# EAGLE design Un_Bus (EAGLE 6.5.0)
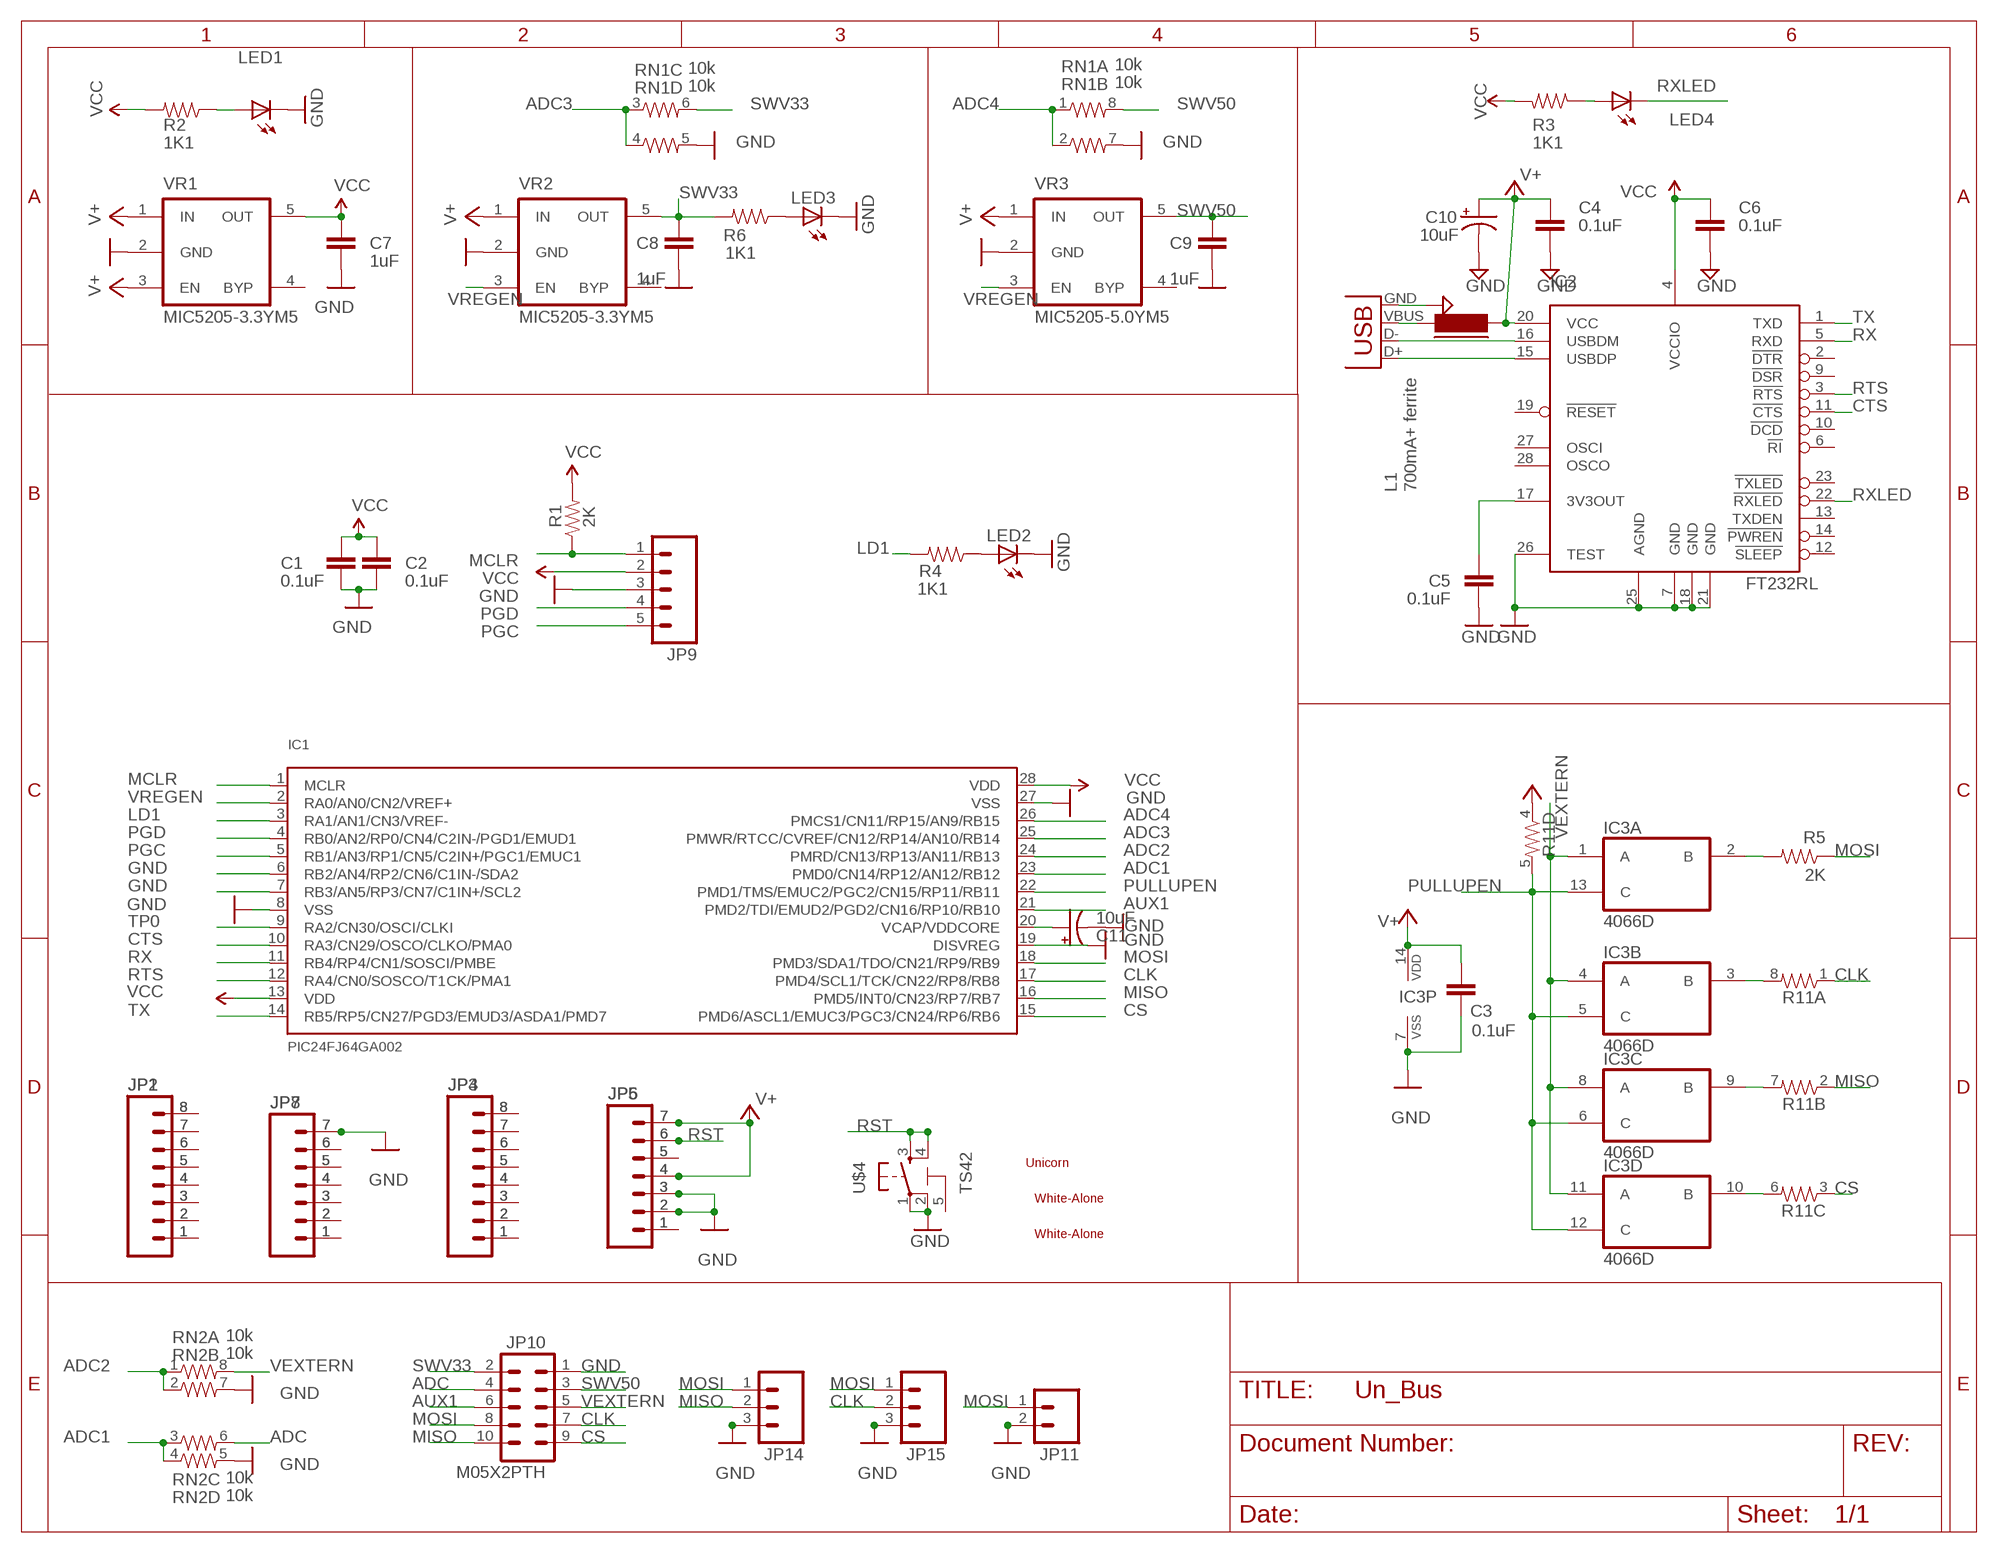
[diagram p0: schematic, sheet 1]

## Parts
C1  0.1uF  CAP0603-CAP  [0603-CAP]
C2  0.1uF  CAP0603-CAP  [0603-CAP]
C3  0.1uF  CAP0603-CAP  [0603-CAP]
C4  0.1uF  CAP0603-CAP  [0603-CAP]
C5  0.1uF  CAP0603-CAP  [0603-CAP]
C6  0.1uF  CAP0603-CAP  [0603-CAP]
C7  1uF  CAP0603-CAP  [0603-CAP]
C8  1uF  CAP0603-CAP  [0603-CAP]
C9  1uF  CAP0603-CAP  [0603-CAP]
C10  10uF  CAP_POL1206  [EIA3216]
C11  10uF  CAP_POL1206  [EIA3216]
IC1  PIC24FJ64GA002  [SSOP28]
IC2  FT232RL  [SSOP28]
IC3  4066D  [SO14]
JP1  M081X08  [1X08]
JP2  M081X08  [1X08]
JP3  M081X08  [1X08]
JP4  M081X08  [1X08]
JP5  M07  [1X07]
JP6  M07  [1X07]
JP7  M07  [1X07]
JP8  M07  [1X07]
JP9  M05PTH  [1X05]
JP10  M05X2PTH  [AVR_ICSP]
JP11  M02PTH  [1X02]
JP14  M03PTH  [1X03]
JP15  M03PTH  [1X03]
L1  700mA+ ferrite  FERRITE-0805  [FB805]
LED1  LED0805  [LED-0805]
LED2  LED0805  [LED-0805]
LED3  LED0805  [LED-0805]
LED4  LED0805  [LED-0805]
R1  2K  RESISTOR0603-RES  [0603-RES]
R2  1K1  RESISTOR0603-RES  [0603-RES]
R3  1K1  RESISTOR0603-RES  [0603-RES]
R4  1K1  RESISTOR0603-RES  [0603-RES]
R5  2K  RESISTOR0603-RES  [0603-RES]
R6  1K1  RESISTOR0603-RES  [0603-RES]
R11  RESISTOR-ARRAY  [RES-NET-0603]
RN1  10k  RESISTOR-ARRAY  [RES-NET-0603]
RN2  10k  RESISTOR-ARRAY  [RES-NET-0603]
U$1  UNICORN  [UNICORN_1]
U$2  WHITE-ALONE_0  [WHITE-ALONE_0]
U$3  WHITE-ALONE_0  [WHITE-ALONE_0]
U$4  TS42  [TS42]
VR1  MIC5205-3.3YM5  MIC5205  [SOT-23-5]
VR2  MIC5205-3.3YM5  MIC5205  [SOT-23-5]
VR3  MIC5205-5.0YM5  MIC5205  [SOT-23-5]
X1  USBSMD  [USB-MINIB]

## Nets
ADC: JP10.4 RN2.6
ADC1: IC1.23(PMD0/CN14/RP12/AN12/RB12) RN2.3 RN2.4
ADC2: IC1.24(PMRD/CN13/RP13/AN11/RB13) RN2.1 RN2.2
ADC3: IC1.25(PMWR/RTCC/CVREF/CN12/RP14/AN10/RB14) RN1.3 RN1.4
ADC4: IC1.26(PMCS1/CN11/RP15/AN9/RB15) RN1.1 RN1.2
AUX1: IC1.21(PMD2/TDI/EMUD2/PGD2/CN16/RP10/RB10) JP10.6
CLK: IC1.17(PMD4/SCL1/TCK/CN22/RP8/RB8) JP10.7 JP15.2 R11.1
CS: IC1.15(PMD6/ASCL1/EMUC3/PGC3/CN24/RP6/RB6) JP10.9 R11.3
CTS: IC1.10(RA3/CN29/OSCO/CLKO/PMA0) IC2.11(!CTS)
GND: C1.2 C2.2 C3.2 C4.2 C5.2 C6.2 C7.2 C8.2 C9.2 C10.C(-) C11.C(-) IC1.6(RB2/AN4/RP2/CN6/C1IN-/SDA2) IC1.7(RB3/AN5/RP3/CN7/C1IN+/SCL2) IC1.8(VSS) IC1.19(DISVREG) IC1.27(VSS) IC2.7(GND) IC2.18(GND) IC2.21(GND) IC2.25(AGND) IC2.26(TEST) IC3.7(P:VSS) JP5.2 JP5.3 JP6.2 JP6.3 JP7.7 JP8.7 JP9.3 JP10.1 JP11.2 JP14.3 JP15.3 LED1.2(C) LED2.2(C) LED3.2(C) RN1.5 RN1.7 RN2.5 RN2.7 U$4.1 U$4.2 VR1.2(GND) VR2.2(GND) VR3.2(GND) X1.GND
LD1: IC1.3(RA1/AN1/CN3/VREF-) R4.2
MCLR: IC1.1(MCLR) JP9.1 R1.1
MISO: IC1.16(PMD5/INT0/CN23/RP7/RB7) JP10.10 JP14.2 R11.2
MOSI: IC1.18(PMD3/SDA1/TDO/CN21/RP9/RB9) JP10.8 JP11.1 JP14.1 JP15.1 R5.1
N$1: IC3.2(A:B) R5.2
N$2: IC3.3(B:B) R11.8
N$3: C11.A(+) IC1.20(VCAP/VDDCORE)
N$4: IC3.10(D:B) R11.6
N$5: IC3.9(C:B) R11.7
N$6: LED2.1(A) R4.1
N$7: LED1.1(A) R2.1
N$8: JP1.1 JP2.1
N$9: C5.1 IC2.17(3V3OUT)
N$10: JP1.2 JP2.2
N$11: JP1.3 JP2.3
N$12: JP1.4 JP2.4
N$13: LED4.1(A) R3.1
N$14: JP1.5 JP2.5
N$15: IC2.15(USBDP) X1.D+
N$16: IC2.16(USBDM) X1.D-
N$17: JP1.6 JP2.6
N$18: LED3.1(A) R6.1
N$19: JP1.7 JP2.7
N$20: JP1.8 JP2.8
N$21: JP3.1 JP4.1
N$22: JP3.2 JP4.2
N$23: JP3.3 JP4.3
N$24: JP3.4 JP4.4
N$25: JP3.5 JP4.5
N$26: JP3.6 JP4.6
N$27: JP3.7 JP4.7
N$28: JP3.8 JP4.8
N$29: JP5.1 JP6.1
N$30: L1.1 X1.VBUS
N$33: JP5.5 JP6.5
N$36: JP7.1 JP8.1
N$37: JP7.2 JP8.2
N$38: JP7.3 JP8.3
N$39: JP7.4 JP8.4
N$40: JP7.5 JP8.5
N$41: JP7.6 JP8.6
PGC: IC1.5(RB1/AN3/RP1/CN5/C2IN+/PGC1/EMUC1) JP9.5
PGD: IC1.4(RB0/AN2/RP0/CN4/C2IN-/PGD1/EMUD1) JP9.4
PULLUPEN: IC1.22(PMD1/TMS/EMUC2/PGC2/CN15/RP11/RB11) IC3.5(B:C) IC3.6(C:C) IC3.12(D:C) IC3.13(A:C) R11.5
RST: JP5.6 JP6.6 U$4.3 U$4.4
RTS: IC1.12(RA4/CN0/SOSCO/T1CK/PMA1) IC2.3(!RTS)
RX: IC1.11(RB4/RP4/CN1/SOSCI/PMBE) IC2.5(RXD)
RXLED: IC2.22(!RXLED) LED4.2(C)
SWV33: C8.1 JP10.2 R6.2 RN1.6 VR2.5(OUT)
SWV50: C9.1 JP10.3 RN1.8 VR3.5(OUT)
TP0: IC1.9(RA2/CN30/OSCI/CLKI)
TX: IC1.14(RB5/RP5/CN27/PGD3/EMUD3/ASDA1/PMD7) IC2.1(TXD)
V+: C3.1 C4.1 C10.A(+) IC2.20(VCC) IC3.14(P:VDD) JP5.4 JP5.7 JP6.4 JP6.7 L1.2 R11.4 VR1.1(IN) VR1.3(EN) VR2.1(IN) VR3.1(IN)
VCC: C1.1 C2.1 C6.1 C7.1 IC1.13(VDD) IC1.28(VDD) IC2.4(VCCIO) JP9.2 R1.2 R2.2 R3.2 VR1.5(OUT)
VEXTERN: IC3.1(A:A) IC3.4(B:A) IC3.8(C:A) IC3.11(D:A) JP10.5 RN2.8
VREGEN: IC1.2(RA0/AN0/CN2/VREF+) VR2.3(EN) VR3.3(EN)
Unconnected: IC2.2(!DTR) IC2.6(!RI) IC2.9(!DSR) IC2.10(!DCD) IC2.12(!SLEEP) IC2.13(TXDEN) IC2.14(!PWREN) IC2.19(!RESET) IC2.23(!TXLED) IC2.27(OSCI) IC2.28(OSCO) U$4.5 VR1.4(BYP) VR2.4(BYP) VR3.4(BYP)

## Library data of the parts
C1-C9 = 2SparkFun:CAP: Capacitor Standard 0603 ceramic capacitor, and 0.1" leaded capacitor.
C10 C11 = 2SparkFun:CAP_POL: Capacitor Polarized These are standard SMD and PTH capacitors. Normally 10uF, 47uF, and 100uF in electrolytic and tantalum varieties. Always verify the external diameter of the through hole cap, it varies with capacity, voltage, and manufacturer. The EIA devices should be standard.
IC1 = dp_devices:PIC24FJ64GA002: 16-bit General Purpose Flash Microcontroller
IC2 = dp_devices:FT232RL: USB to serial UART interface
IC3 = 40xx:4066: Quad bilateral ANALOG SWITCH
JP1-JP4 = 2SparkFun:M08: Header 8 Standard 8-pin 0.1" header. Use with straight break away headers (SKU : PRT-00116), right angle break away headers (PRT-00553), swiss pins (PRT-00743), machine pins (PRT-00117), and female headers (PRT-00115).
JP5-JP8 = 2SparkFun:M07: Header 7 Standard 7-pin 0.1" header. Use with straight break away headers (SKU : PRT-00116), right angle break away headers (PRT-00553), swiss pins (PRT-00743), machine pins (PRT-00117), and female headers (PRT-00115). NOTES ON THE VARIANTS LOCK and LOCK_LONGPADS... This footprint was designed to help hold the alignment of a through-hole component (i.e. 7-pin header) while soldering it into place. You may notice that each hole has been shifted either up or down by 0.005 of an inch from it's more standard position (which is usually a perfectly straight line). This slight alteration caused the pins (the squares in the middle) to touch the edges of the holes. Because they are alternating, it causes a "brace" to hold the header in place. 0.005 has proven to be the perfect amount of "off-center" position when using our standard breakaway headers. Although looks a little odd when you look at the bare footprint, once you have a header in there, the alteration is very hard to notice. Also, if you push a header all the way into place, it is covered up entirely on the bottom side. This idea of altering the position of holes to aid alignment will be further integrated into the Sparkfun Library for other footprints. It can help hold any component with 3 or more connection pins.
JP9 = 2SparkFun:M05: Header 5 Standard 5-pin 0.1" header. Use with straight break away headers (SKU : PRT-00116), right angle break away headers (PRT-00553), swiss pins (PRT-00743), machine pins (PRT-00117), and female headers (PRT-00115). Molex polarized connector foot print use with SKU : PRT-08230 with associated crimp pins and housings.
JP10 = 2SparkFun:M05X2: Header 5x2 Standard 10-pin dual row 0.1" header. Commonly used with AVR-ISP. Use with Spark Fun Electronics SKU: PRT-00778
JP11 = 2SparkFun:M02: Header 2 Standard 2-pin 0.1" header. Use with straight break away headers (SKU : PRT-00116), right angle break away headers (PRT-00553), swiss pins (PRT-00743), machine pins (PRT-00117), and female headers (PRT-00115). Molex polarized connector foot print use with SKU : PRT-08233 with associated crimp pins and housings.
JP14 JP15 = 2SparkFun:M03: Header 3 Standard 3-pin 0.1" header. Use with straight break away headers (SKU : PRT-00116), right angle break away headers (PRT-00553), swiss pins (PRT-00743), machine pins (PRT-00117), and female headers (PRT-00115). Molex polarized connector foot print use with SKU : PRT-08232 with associated crimp pins and housings.
L1 = 2SparkFun:FERRITE: Ferrite bead in various packages
LED1-LED4 = 2SparkFun:LED: LEDs Standard schematic elements and footprints for 5mm, 3mm, 1206, and 0603 sized LEDs. 5mm - Spark Fun Electronics SKU : COM-00529 (and others)
R1 R5 = 2SparkFun:RESISTOR: Resistor
R2-R4 R6 = 1SparkFun:RESISTOR: Resistor
R11 RN1 RN2 = 2SparkFun:RESISTOR-ARRAY: Array Chip Resistor Source: RS Component / Phycomp
U$1 = 2SparkFun:UNICORN
U$2 U$3 = 2SparkFun:WHITE-ALONE
U$4 = 2SparkFun:TS42
VR1-VR3 = dp_devices:MIC5205: 150ma Low-Noise LDO Regulator
X1 = 2SparkFun:USB: USB Connectors USB-B-PTH is fully proven SKU : PRT-00139 USB-miniB is fully proven SKU : PRT-00587 USB-A-PCB is untested. USB-A-H is throughly reviewed, but untested. Spark Fun Electronics SKU : PRT-00437 USB-B-SMT is throughly reviewed, but untested. Needs silkscreen touching up. USB-A-S has not been used/tested USB-MB-H has not been used/tested

## Net classes
0 default: width 0.254 mm, clearance 0.254 mm
2 gnd: width 0.305 mm, drill 0.559 mm, clearance 0.254 mm

## Board
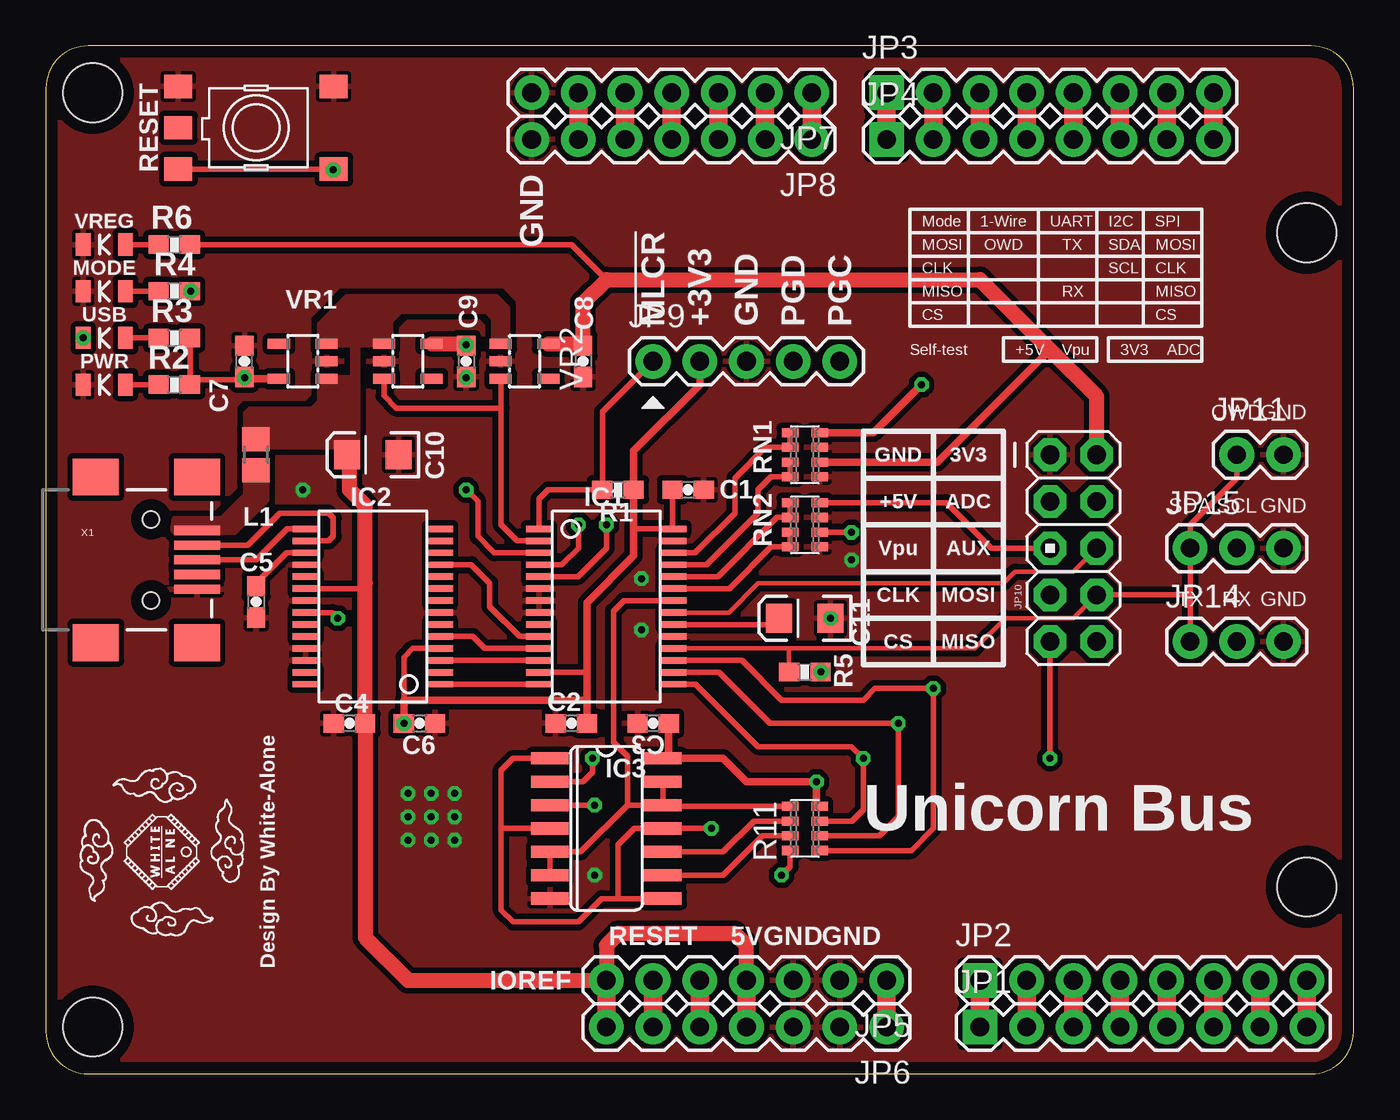
[diagram p1: board, top side]
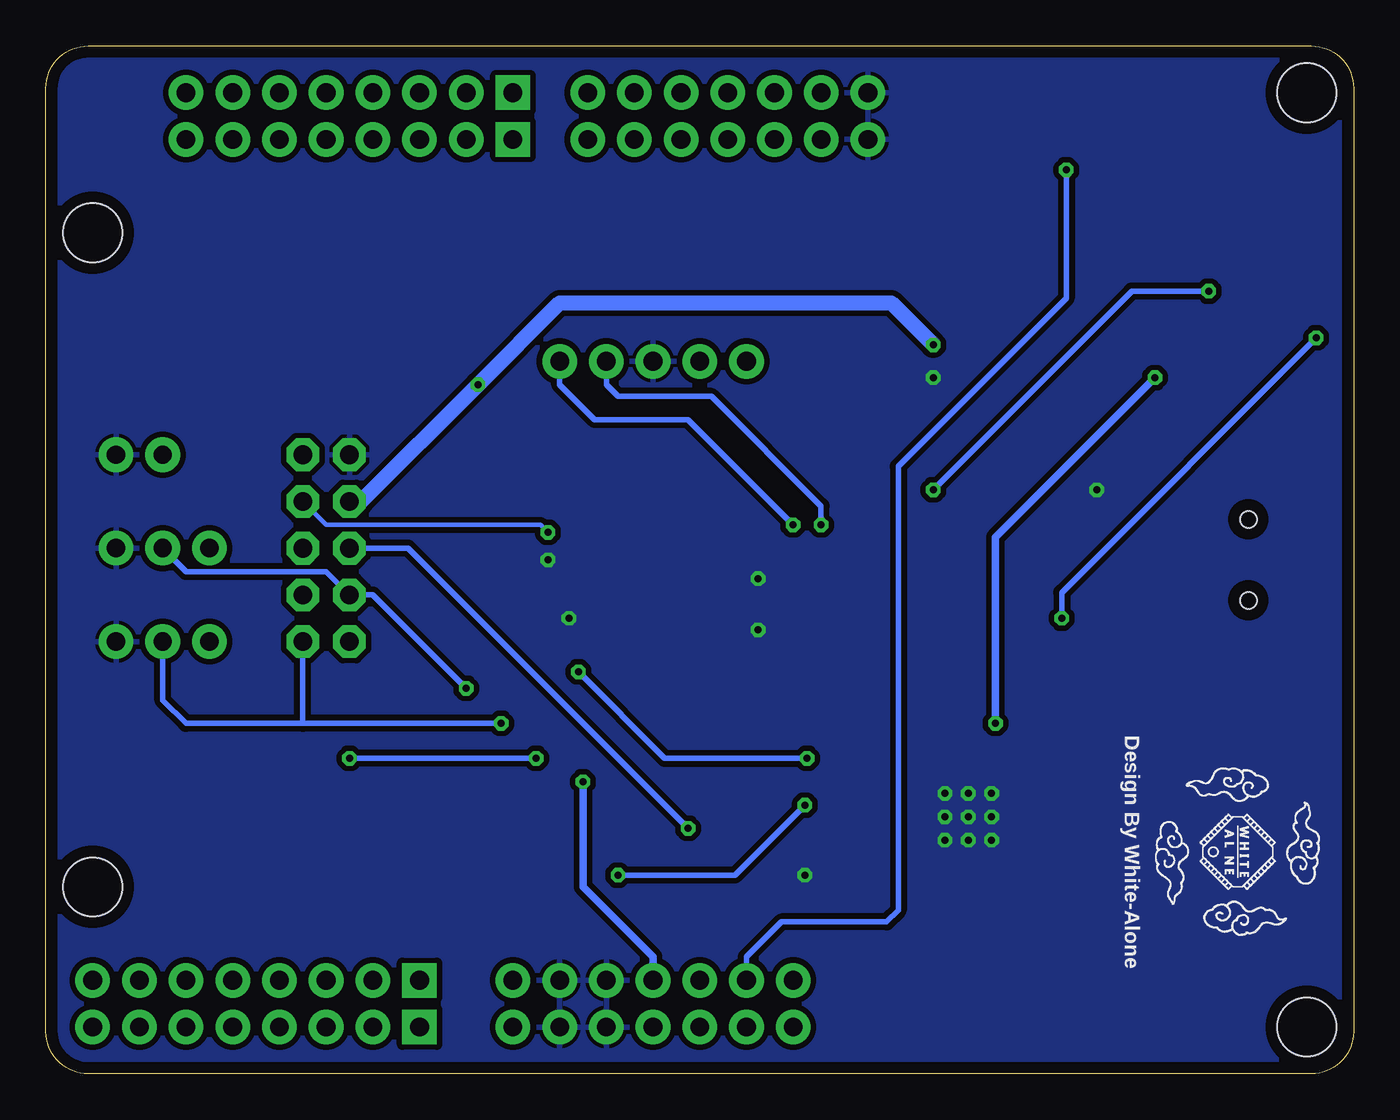
[diagram p2: board, bottom side, seen from below]

Size 71.12 x 55.88 mm. Coordinates in mm from the lower left corner, seen from the top.
Copper layers (1*16): Top 0.035mm / dielectric 1.5mm / Bottom 0.035mm
Design rules "yun": minimum track width 8mil, minimum drill 15mil, track to track 8mil, track to pad 8mil, pad to pad 8mil, via to via 8mil, smd to smd 8mil, copper to edge 25mil, drill to drill 8mil, minimum pad ring 10mil, minimum via ring 8mil, stop-mask expansion 4mil, vias tented up to drill 20mil, thermal gap 8mil

### Footprints (pad centres in the part's own frame; a part is rotated, then mirrored left to right if it is on the bottom)
0603-CAP = smd 1.1 x 1: 1 -0.85,0; 2 0.85,0
EIA3216 = smd 1.4 x 1.6: A 1.4,0; C -1.4,0
SSOP28 = smd 0.348 x 1.397: 1 -4.225,-3.656; 2 -3.575,-3.656; 3 -2.925,-3.656; 4 -2.275,-3.656; 5 -1.625,-3.656; 6 -0.975,-3.656; 7 -0.325,-3.656; 8 0.325,-3.656; 9 0.975,-3.656; 10 1.625,-3.656; 11 2.275,-3.656; 12 2.925,-3.656; 13 3.575,-3.656; 14 4.225,-3.656; 15 4.225,3.656; 16 3.575,3.656; 17 2.925,3.656; 18 2.275,3.656; 19 1.625,3.656; 20 0.975,3.656; 21 0.325,3.656; 22 -0.325,3.656; 23 -0.975,3.656; 24 -1.625,3.656; 25 -2.275,3.656; 26 -2.925,3.656; 27 -3.575,3.656; 28 -4.225,3.656
SO14 = smd 0.66 x 2.032: 1 -3.81,-3.073; 2 -2.54,-3.073; 3 -1.27,-3.073; 4 0,-3.073; 5 1.27,-3.073; 6 2.54,-3.073; 7 3.81,-3.073; 8 3.81,3.073; 9 2.54,3.073; 10 1.27,3.073; 11 0,3.073; 12 -1.27,3.073; 13 -2.54,3.073; 14 -3.81,3.073
1X08 = drill 1.016 pad 1.88 square: 1 0,0 | drill 1.016 pad 1.88: 2 2.54,0; 3 5.08,0; 4 7.62,0; 5 10.16,0; 6 12.7,0; 7 15.24,0; 8 17.78,0
1X07 = drill 1.016 pad 1.88: 1 0,0; 2 2.54,0; 3 5.08,0; 4 7.62,0; 5 10.16,0; 6 12.7,0; 7 15.24,0
1X05 = drill 1.016 pad 1.88: 1 0,0; 2 2.54,0; 3 5.08,0; 4 7.62,0; 5 10.16,0
AVR_ICSP = drill 1.016 pad 1.778 octagon: 1 -1.27,5.08; 2 1.27,5.08; 3 -1.27,2.54; 4 1.27,2.54; 5 -1.27,0; 6 1.27,0; 7 -1.27,-2.54; 8 1.27,-2.54; 9 -1.27,-5.08; 10 1.27,-5.08
1X02 = drill 1 pad 1.88: 1 0,0; 2 2.54,0
1X03 = drill 1 pad 1.88: 1 0,0; 2 2.54,0; 3 5.08,0
FB805 = smd 1.3 x 1.5: 1 -0.85,0; 2 0.85,0
LED-0805 = smd 0.8 x 1.2: 1 -1.154,0; 2 1.154,0
0603-RES = smd 1.1 x 1: 1 -0.85,0; 2 0.85,0
RES-NET-0603 = smd 0.5 x 0.9: 1 -1.2,-0.8; 2 -0.4,-0.8; 3 0.4,-0.8; 4 1.2,-0.8; 5 1.2,0.8; 6 0.4,0.8; 7 -0.4,0.8; 8 -1.2,0.8
UNICORN_1 = hole 3.2: -30.48,-25.4; 35.56,17.78; 35.56,-17.78; -30.48,25.4
TS42 = smd 1.524 x 1.27: 1 -4.229,2.25; 2 4.229,2.25; 3 -4.229,-2.25; 4 4.229,-2.25; 5 -4.229,-0.002
SOT-23-5 = smd 0.55 x 1.2: 1 -0.95,-1.3; 2 0,-1.3; 3 0.95,-1.3; 4 0.95,1.3; 5 -0.95,1.3
USB-MINIB = smd 2.5 x 0.5: D+ 2.5,0; D- 2.5,0.8; GND 2.5,-1.6; ID 2.5,-0.8; VBUS 2.5,1.6 | smd 2.5 x 2: MTN1 -3,4.5; MTN2 2.5,4.5; MTN3 -3,-4.5; MTN4 2.5,-4.5 | hole 0.9: 0,2.2; 0,-2.2

### Placement (x,y rotation side)
C1  34.92,31.75 0 top
C2  28.57,19.05 180 top
C3  33.02,19.05 180 top
C4  16.51,19.05 180 top
C5  11.43,25.65 270 top
C6  20.32,19.05 0 top
C7  10.79,38.73 90 top
C8  29.21,38.73 270 top
C9  22.86,38.73 270 top
C10  17.78,33.66 180 top
C11  41.27,24.77 180 top
IC1  30.48,25.4 270 top
IC2  17.78,25.4 90 top
IC3  30.48,13.34 270 top
JP1  50.8,2.54 0 top
JP2  50.8,5.08 0 top
JP3  45.72,53.34 0 top
JP4  45.72,50.8 0 top
JP5  45.72,5.08 180 top
JP6  45.72,2.54 180 top
JP7  41.66,53.34 180 top
JP8  41.66,50.8 180 top
JP9  33.02,38.73 0 top
JP10  55.88,28.57 0 top
JP11  64.77,33.66 0 top
JP14  62.23,23.5 0 top
JP15  62.23,28.57 0 top
L1  11.43,33.66 90 top
LED1  3.17,37.47 180 top
LED2  3.17,42.55 180 top
LED3  3.17,45.09 180 top
LED4  3.17,40.01 180 top
R1  31.11,31.75 0 top
R2  6.99,37.47 0 top
R3  6.99,40.01 0 top
R4  6.99,42.55 0 top
R5  41.27,21.84 0 top
R6  6.99,45.09 0 top
R11  41.27,13.34 90 top
RN1  41.27,33.66 270 top
RN2  41.27,29.84 270 top
U$1  33.02,27.94 0 top
U$2  6.35,12.06 90 top
U$3  6.35,12.06 270 bottom
U$4  11.43,51.44 0 top
VR1  13.97,38.73 90 top
VR2  26.04,38.73 270 top
VR3  19.68,38.73 270 top
X1  5.71,27.94 0 top

### Tracks (layer width: path | path; a pad name or v marks a point on that pad's centre or on a via)
ADC  (via drill 0.38)
  Top 0.305: v43.81,29.44 42.71,29.44 RN2.6
  Bottom 0.254: JP10.4 55.88,29.84 44.22,29.84 v43.81,29.44
ADC1
  Top 0.305: RN2.3 RN2.4 39.44,28.64 37.17,26.38 IC1.23
ADC2
  Top 0.305: RN2.1 RN2.2 39.77,30.25 36.55,27.02 IC1.24
ADC3
  Top 0.305: RN1.3 RN1.4 39.44,32.45 38.73,31.75 38.73,30.48 35.93,27.68 IC1.25
ADC4
  Top 0.305: RN1.1 RN1.2 39.13,34.05 37.47,32.38 37.47,30.48 35.31,28.32 IC1.26
AUX1
  Top 0.254: IC1.21 37.14,25.07 38.73,26.67 52.07,26.67 52.7,27.3 55.88,27.3 JP10.6
CLK  (via drill 0.38)
  Top 0.305: IC1.17 37.85,22.48 40.01,20.32 44.45,20.32 45.09,20.95 v48.26,20.95 48.26,13.34 47.06,12.13 R11.1
  Bottom 0.305: v48.26,20.95 53.34,26.04 JP10.7 55.88,27.3 63.5,27.3 JP15.2
CS  (via drill 0.38)
  Top 0.305: IC1.15 35.34,21.18 38.73,17.78 43.81,17.78 v44.45,17.14 44.45,14.35 43.83,13.73 R11.3 | v54.61,17.14 JP10.9
  Bottom 0.305: v44.45,17.14 v54.61,17.14
CTS
  Top 0.305: IC1.10 25.75,23.77 24.13,25.4 24.13,26.67 23.12,27.68 IC2.11
GND  (via drill 0.38)
  other vias: 19.68,15.24 20.95,15.24 22.23,15.24 22.23,13.97 20.95,13.97 19.68,13.97 19.68,12.7 20.95,12.7 22.23,12.7 22.86,37.85 42.67,24.77 32.38,26.92 43.81,27.94 32.38,24.13 29.84,10.79 13.97,31.75
  pour Top (isolate 0.305, rank 2): 0,0 70.92,0 71.12,0.2 71.12,55.88 0.2,55.88 0,55.68
  pour Bottom (isolate 0.305, rank 2): 0,0 70.92,0 71.12,0.2 71.12,55.88 0.2,55.88 0,55.68
LD1  (via drill 0.38)
  Top 0.305: IC1.3 24.38,28.32 23.5,29.21 23.5,31.11 v22.86,31.75 | R4.2 v7.87,42.55
  Bottom 0.305: v7.87,42.55 12.06,42.55 v22.86,31.75
MCLR
  Top 0.305: IC1.1 26.82,31.27 27.3,31.75 R1.1 30.27,35.98 JP9.1
MISO  (via drill 0.38)
  Top 0.305: IC1.16 36.59,21.82 39.37,19.05 v46.35,19.05 46.35,13.97 45.32,12.94 R11.2
  Bottom 0.305: v46.35,19.05 57.15,19.05 | 57.15,19.05 63.5,19.05 64.77,20.32 JP14.2 | 57.15,19.05 JP10.10
MOSI
  Top 0.254: IC1.18 40.42,23.12 | R5.1 40.42,23.12 | 40.42,23.12 50.53,23.12 52.17,24.77 55.88,24.77 JP10.8
  Top 0.305: JP14.1 62.23,26.04 | 62.23,26.04 JP15.1 62.23,29.84 64.77,32.38 JP11.1 | JP10.8 62.23,26.04
N$1  (via drill 0.38)
  Top 0.305: v29.72,17.14 29.72,16.38 29.21,15.88 IC3.2 | v42.16,21.84 R5.2
  Bottom 0.305: v42.16,21.84 37.47,17.14 v29.72,17.14
N$2  (via drill 0.38)
  Top 0.305: IC3.3 v29.84,14.61 | R11.8 40.48,11.27 v40.01,10.79
  Bottom 0.305: v29.84,14.61 33.66,10.79 v40.01,10.79
N$3
  Top 0.305: IC1.20 40.17,24.43 C11.A
N$4
  Top 0.305: R11.6 38.5,13.73 36.83,12.06 IC3.10
N$5
  Top 0.305: R11.7 38.97,12.94 36.83,10.79 IC3.9
N$6
  Top 0.305: LED2.1 R4.1
N$7
  Top 0.305: R2.1 LED1.1
N$8
  Top 1.016: JP1.1 JP2.1
N$9
  Top 0.305: IC2.17 13.09,28.32 11.43,26.67 C5.1
N$10
  Top 1.016: JP1.2 JP2.2
N$11
  Top 1.016: JP1.3 JP2.3
N$12
  Top 1.016: JP1.4 JP2.4
N$13
  Top 0.305: R3.1 LED4.1
N$14
  Top 1.016: JP1.5 JP2.5
N$15
  Top 0.305: IC2.15 13.12,29.62 11.43,27.94 X1.D+
N$16
  Top 0.305: X1.D- 10.96,28.74 12.7,30.48 15.37,30.48 15.62,30.23 15.62,29.21 15.39,28.98 IC2.16
N$17
  Top 1.016: JP1.6 JP2.6
N$18
  Top 0.305: LED3.1 R6.1
N$19
  Top 1.016: JP1.7 JP2.7
N$20
  Top 1.016: JP1.8 JP2.8
N$21
  Top 1.016: JP3.1 JP4.1
N$22
  Top 1.016: JP4.2 JP3.2
N$23
  Top 1.016: JP4.3 JP3.3
N$24
  Top 1.016: JP4.4 JP3.4
N$25
  Top 1.016: JP4.5 JP3.5
N$26
  Top 1.016: JP4.6 JP3.6
N$27
  Top 1.016: JP4.7 JP3.7
N$28
  Top 1.016: JP3.8 JP4.8
N$29
  Top 1.016: JP6.1 JP5.1
N$30
  pour Top (isolate 0.305, no thermals): 6.99,29.39 10.29,29.39 12.06,31.17 12.06,33.27 10.79,33.27 10.79,31.5 9.53,30.23 6.99,30.23 6.86,30.1 6.86,29.51
N$33
  Top 1.016: JP6.5 JP5.5
N$36
  Top 1.016: JP8.1 JP7.1
N$37
  Top 1.016: JP8.2 JP7.2
N$38
  Top 1.016: JP8.3 JP7.3
N$39
  Top 1.016: JP8.4 JP7.4
N$40
  Top 1.016: JP8.5 JP7.5
N$41
  Top 1.016: JP8.6 JP7.6
PGC  (via drill 0.38)
  Top 0.305: IC1.5 28.93,27.02 30.48,28.57 v30.48,29.84
  Bottom 0.305: v30.48,29.84 36.2,35.56 41.27,35.56 43.18,37.47 JP9.5
PGD  (via drill 0.38)
  Top 0.305: IC1.4 28.06,27.68 28.96,28.57 v28.96,29.84
  Bottom 0.305: JP9.4 40.64,37.47 40.01,36.83 34.92,36.83 28.96,30.86 v28.96,29.84
PULLUPEN
  Top 0.305: IC3.6 IC3.5 29.08,12.06 31.62,14.61 | IC3.13 IC3.12 33.02,14.61 | 33.02,14.61 31.62,14.61 | IC1.22 31.44,25.73 30.86,25.15 30.86,18.03 31.62,17.27 31.62,14.61 | R11.5 33.09,14.54 33.02,14.61
RST  (via drill 0.38)
  Top 0.305: U$4.3 U$4.4 v15.62,49.15
  Top 1.016: JP5.6 JP6.6
  Bottom 0.305: JP5.6 33.02,6.35 31.11,8.26 25.4,8.26 24.77,8.89 24.77,33.02 15.62,42.16 v15.62,49.15
RTS
  Top 0.305: IC2.3 IC1.12
RX
  Top 0.305: IC1.11 23.86,23.12 23.21,23.77 IC2.5
RXLED  (via drill 0.38)
  Top 0.305: 1.91,39.89 LED4.2 v2.03,40.01 | v15.88,24.77 15.56,25.07 IC2.22
  Bottom 0.305: v2.03,40.01 15.88,26.16 v15.88,24.77
SWV33
  Top 0.305: R6.2 28.57,45.09 30.48,43.18
  Top 0.406: RN1.6 48.49,33.26 54.61,39.37
  Top 0.813: VR2.5 29.11,39.69 C8.1 29.21,41.91 30.48,43.18 50.8,43.18 54.61,39.37 57.15,36.83 JP10.2
SWV50  (via drill 0.38)
  Top 0.406: RN1.8 45.02,34.85 v47.62,37.47
  Top 0.813: C9.1 v22.86,39.62 22.8,39.69 VR3.5
  Bottom 0.813: v22.86,39.62 25.15,41.91 43.18,41.91 v47.62,37.47 53.98,31.11 JP10.3
TX
  Top 0.305: IC2.1 IC1.14
V+  (via drill 0.38)
  Top 0.305: IC2.20 17.07,26.38 17.36,26.67
  Top 0.406: 33.87,17.14 36.83,17.14 38.1,15.88 v41.91,15.88 41.91,14.7 R11.4 | 33.87,17.14 IC3.14 | C3.1 33.87,17.14
  Top 0.813: JP5.4 38.1,6.99 37.47,7.62 31.11,7.62 30.48,6.99 JP5.7 19.68,5.08 17.36,7.41 C4.1 17.36,26.67 17.36,30.9 16.51,31.75 16.51,33.52 C10.A
  Top 1.016: JP5.7 JP6.7 | JP6.4 JP5.4
  Bottom 0.406: v41.91,15.88 41.91,10.16 38.1,6.35 JP5.4
  pour Top (isolate 0.305, no thermals): 10.79,34.04 17.02,34.04 17.02,39.57 18.8,39.57 18.8,40.89 19.3,41.4 23.93,41.4 24.28,41.02 24.28,39.62 25.17,39.62 25.17,41.66 24.54,42.29 16.33,42.29 14.83,40.77 14.83,39.57 16.64,39.57 16.64,37.9 14.83,37.9 14.83,36.58 14.45,36.2 11.05,36.2 10.79,35.94
VCC  (via drill 0.38)
  Top 0.305: 34.14,31.69 C1.1 34.08,29.62 IC1.28 31.96,29.62 | 10.89,37.78 C7.1 v10.79,37.85 10.67,37.72 8.09,37.72 R2.2 R3.2 | IC1.13 29.43,21.82 | IC2.4 19.95,23.12 19.47,22.64 19.47,20.32
  Top 0.406: VR1.5 10.89,37.78 | 29.43,20.32 29.43,21.82 29.43,25.61 31.96,28.16 31.96,29.62 R1.2 31.96,33.87 35.56,37.47 JP9.2 | 29.43,20.32 C2.1 | C6.1 19.47,20.32 29.43,20.32
  Bottom 0.406: C6.1 19.47,29.17 v10.79,37.85
  other vias: 19.47,19.05
VEXTERN  (via drill 0.38)
  Top 0.305: IC3.1 25.4,17.14 24.77,16.51 24.77,13.34 | IC3.4 24.77,13.34 | RN2.8 48.97,31.05 51.44,28.57 JP10.5 | 31.11,9.53 30.23,9.53 28.96,8.26 25.4,8.26 24.77,8.89 24.77,13.34 | 31.11,9.53 IC3.8 | v36.2,13.34 IC3.11 32,13.34 31.11,12.45 31.11,9.53
  Bottom 0.305: v36.2,13.34 51.44,28.57 JP10.5
VREGEN
  Top 0.305: 24.77,36.2 24.77,37.76 VR2.3 | VR3.3 18.39,36.86 19.05,36.2 24.77,36.2 | IC1.2 25.64,28.98 24.77,29.84 24.77,36.2

### Text on the board
tPlace: RESET | GND | VREG | Mode | 1-Wire | UART | I2C | SPI | MOSI | OWD | TX | SDA | MOSI | MODE | CLK | SCL | CLK | MISO | RX | MISO | USB | !MLCR | +3V3 | GND | PGD | PGC | CS | CS | PWR | Self-test | +5V | Vpu | 3V3 | ADC | OWD | GND | GND | 3V3 | +5V | ADC | SDA | SCL | GND | Vpu | AUX | CLK | MOSI | TX | RX | GND | CS | MISO | Unicorn Bus | Design By White-Alone | RESET | 5V | GND | GND | IOREF
bPlace: Design By White-Alone
Reference: GND | +3v | +5v | ADC | USB | Vpu | AUX | CLK | MOSI | CS | MISO | I/O header | MCLR | +3.3V | GND | DATA | CLOCK